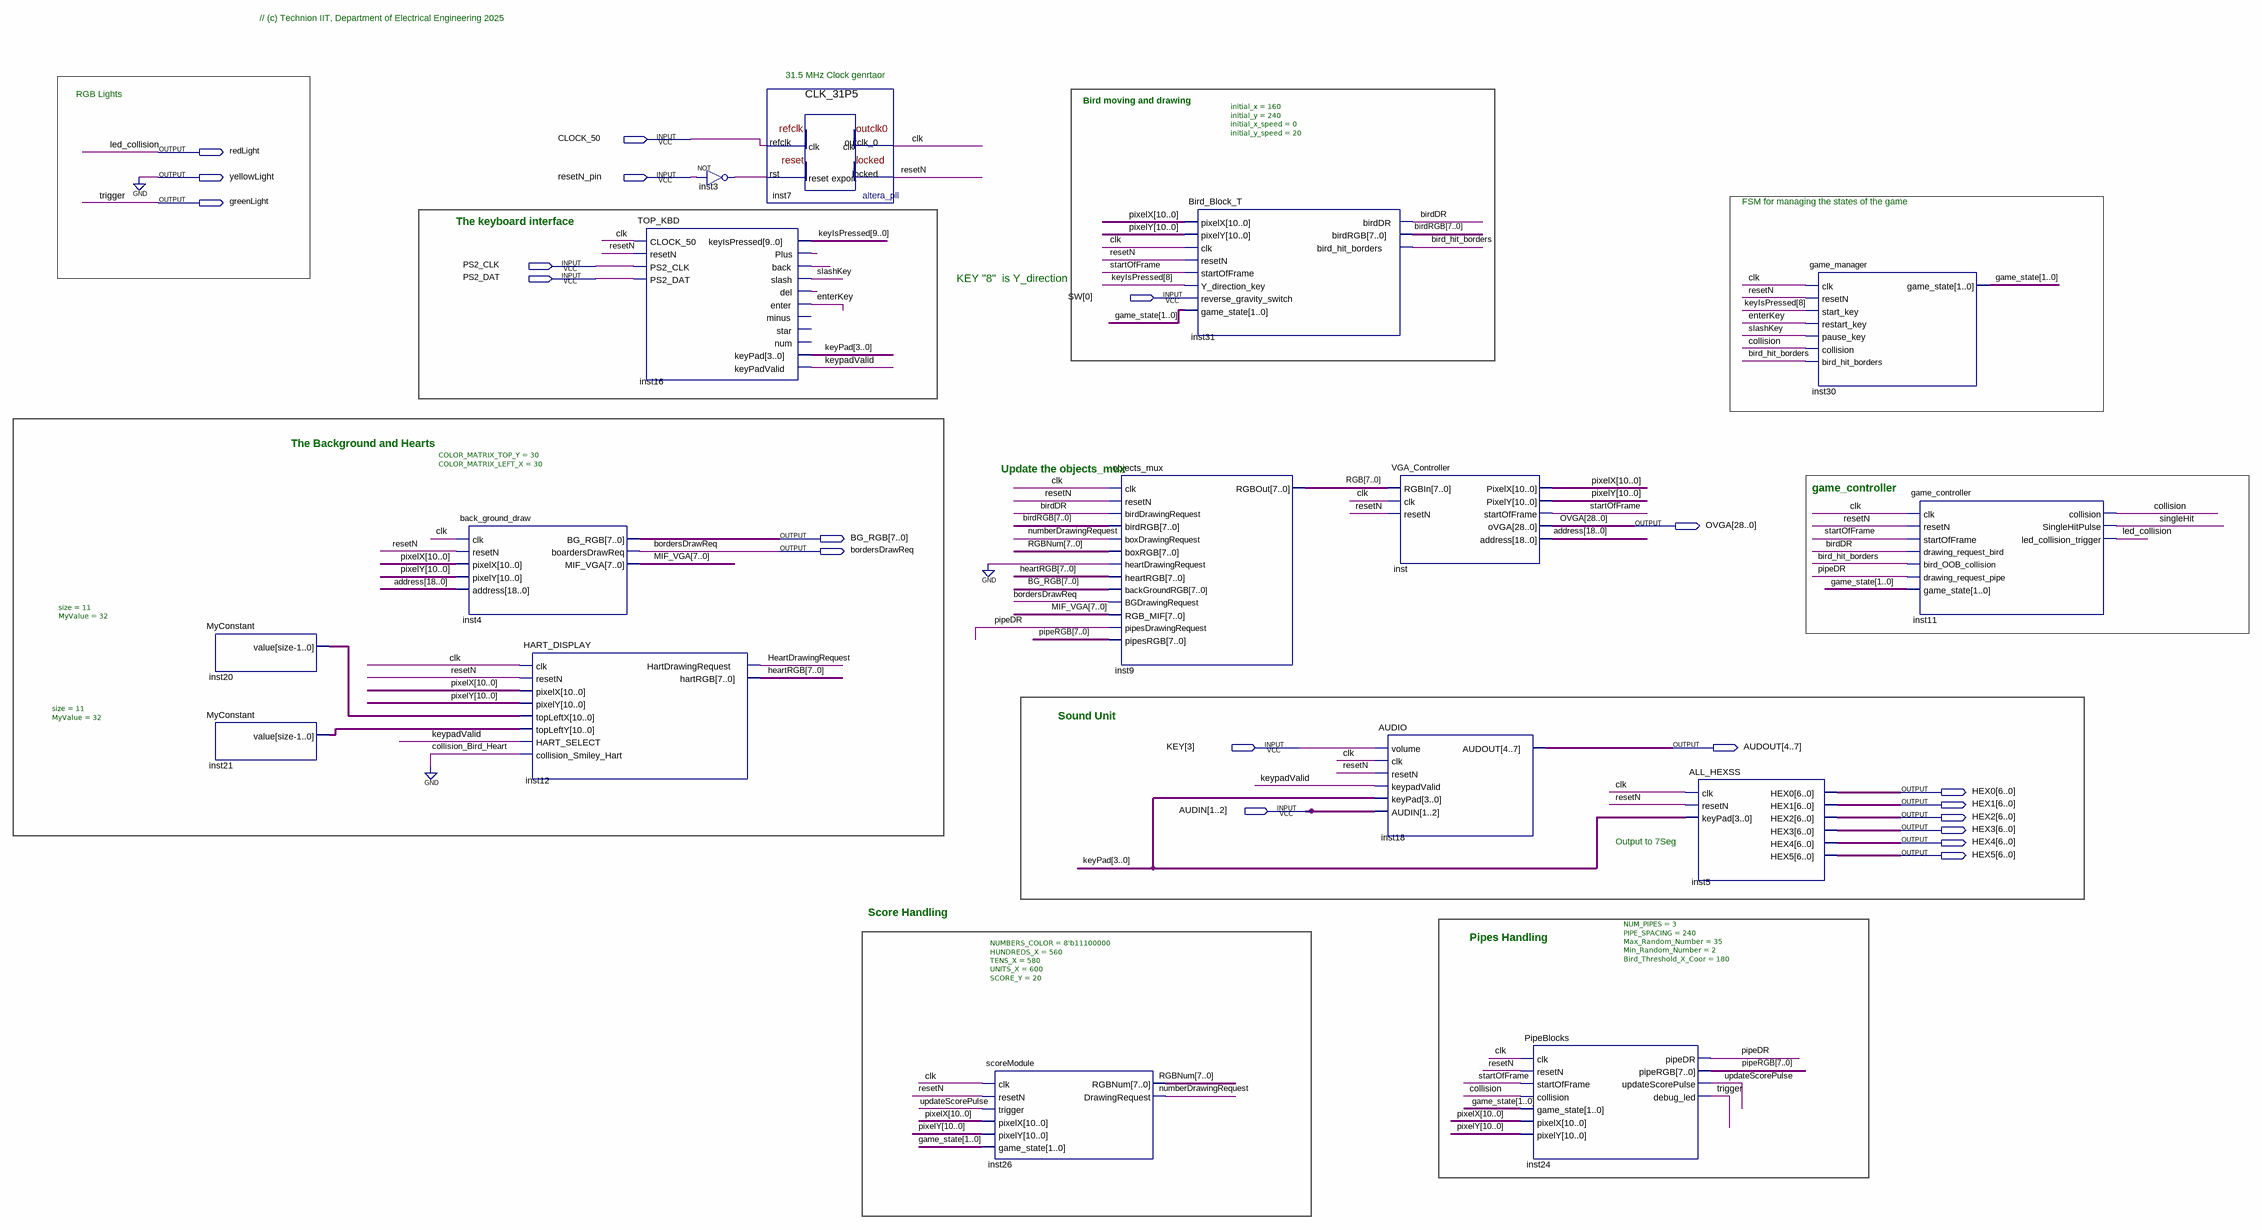
[diagram p0: schematic sheet]
// Quartus schematic TOP_VGA_DEMO.bdf as structural Verilog: 16 symbols, 20 pins
module TOP_VGA_DEMO (
  input  CLOCK_50,
  input  resetN_pin,
  input  PS2_CLK,
  input  PS2_DAT,
  input  [0:0] SW,
  input  [3:3] KEY,
  input  [1:2] AUDIN,
  output redLight,
  output yellowLight,
  output greenLight,
  output [28:0] OVGA,
  output [7:0] BG_RGB,
  output bordersDrawReq,
  output [4:7] AUDOUT,
  output [6:0] HEX0,
  output [6:0] HEX1,
  output [6:0] HEX2,
  output [6:0] HEX3,
  output [6:0] HEX4,
  output [6:0] HEX5
);

  wire bird_hit_borders, birdDR, clk, collision, enterKey, HeartDrawingRequest, inst3_out, inst16_back,
       inst16_del, inst16_plus, keypadValid, numberDrawingRequest, pipeDR, resetN, singleHit, slashKey,
       startOfFrame, updateScorePulse;
  wire [1:0] game_state;
  wire [3:0] keyPad;
  wire [7:0] birdRGB, heartRGB, MIF_VGA, pipeRGB, RGB, RGBNum;
  wire [9:0] keyIsPressed;
  wire [10:0] inst20_value, inst21_value, pixelX, pixelY;
  wire [18:0] address;

  MyConstant #(.size(11), .MyValue(32)) inst20 (.value(inst20_value));
  MyConstant #(.size(11), .MyValue(32)) inst21 (.value(inst21_value));
  back_ground_draw #(.COLOR_MATRIX_TOP_Y(30), .COLOR_MATRIX_LEFT_X(30)) inst4 (
    .clk(clk), .resetN(resetN), .pixelX(pixelX), .pixelY(pixelY), .address(address), .BG_RGB(BG_RGB),
    .boardersDrawReq(bordersDrawReq), .MIF_VGA(MIF_VGA));
  HART_DISPLAY inst12 (
    .clk(clk), .resetN(resetN), .pixelX(pixelX), .pixelY(pixelY), .topLeftX(inst20_value),
    .topLeftY(inst21_value), .HART_SELECT(keypadValid), .collision_Smiley_Hart(1'b0),
    .HartDrawingRequest(HeartDrawingRequest), .hartRGB(heartRGB));
  TOP_KBD inst16 (
    .CLOCK_50(clk), .resetN(resetN), .PS2_CLK(PS2_CLK), .PS2_DAT(PS2_DAT), .keyIsPressed(keyIsPressed),
    .Plus(inst16_plus), .back(inst16_back), .slash(slashKey), .del(inst16_del), .enter(enterKey),
    .keyPad(keyPad), .keyPadValid(keypadValid));  // open: minus, star, num
  not inst3 (inst3_out, resetN_pin);
  CLK_31P5 inst7 (.refclk(CLOCK_50), .rst(inst3_out), .outclk_0(clk), .locked(resetN));
  scoreModule #(.NUMBERS_COLOR(8'b11100000), .HUNDREDS_X(560), .TENS_X(580), .UNITS_X(600), .SCORE_Y(20)) inst26 (
    .clk(clk), .resetN(resetN), .trigger(updateScorePulse), .pixelX(pixelX), .pixelY(pixelY),
    .game_state(game_state), .RGBNum(RGBNum), .DrawingRequest(numberDrawingRequest));
  objects_mux inst9 (
    .clk(clk), .resetN(resetN), .birdDrawingRequest(birdDR), .birdRGB(birdRGB),
    .boxDrawingRequest(numberDrawingRequest), .boxRGB(RGBNum), .heartDrawingRequest(1'b0),
    .heartRGB(heartRGB), .backGroundRGB(BG_RGB), .BGDrawingRequest(bordersDrawReq), .RGB_MIF(MIF_VGA),
    .pipesDrawingRequest(pipeDR), .pipesRGB(pipeRGB), .RGBOut(RGB));
  Bird_Block_T #(.initial_x(160), .initial_y(240), .initial_x_speed(0), .initial_y_speed(20)) inst31 (
    .pixelX(pixelX), .pixelY(pixelY), .clk(clk), .resetN(resetN), .startOfFrame(startOfFrame),
    .Y_direction_key(keyIsPressed[8]), .reverse_gravity_switch(SW[0]), .game_state(game_state),
    .birdDR(birdDR), .birdRGB(birdRGB), .bird_hit_borders(bird_hit_borders));
  VGA_Controller inst (
    .RGBIn(RGB), .clk(clk), .resetN(resetN), .PixelX(pixelX), .PixelY(pixelY), .startOfFrame(startOfFrame),
    .oVGA(OVGA), .address(address));
  AUDIO inst18 (
    .volume(KEY[3]), .clk(clk), .resetN(resetN), .keypadValid(keypadValid), .keyPad(keyPad), .AUDIN(AUDIN),
    .AUDOUT(AUDOUT));
  PipeBlocks #(.NUM_PIPES(3), .PIPE_SPACING(240), .Max_Random_Number(35), .Min_Random_Number(2), .Bird_Threshold_X_Coor(180)) inst24 (
    .clk(clk), .resetN(resetN), .startOfFrame(startOfFrame), .collision(collision), .game_state(game_state),
    .pixelX(pixelX), .pixelY(pixelY), .pipeDR(pipeDR), .pipeRGB(pipeRGB),
    .updateScorePulse(updateScorePulse), .debug_led(greenLight));
  ALL_HEXSS inst5 (
    .clk(clk), .resetN(resetN), .keyPad(keyPad), .HEX0(HEX0), .HEX1(HEX1), .HEX2(HEX2), .HEX3(HEX3),
    .HEX4(HEX4), .HEX5(HEX5));
  game_manager inst30 (
    .clk(clk), .resetN(resetN), .start_key(keyIsPressed[8]), .restart_key(enterKey), .pause_key(slashKey),
    .collision(collision), .bird_hit_borders(bird_hit_borders), .game_state(game_state));
  game_controller inst11 (
    .clk(clk), .resetN(resetN), .startOfFrame(startOfFrame), .drawing_request_bird(birdDR),
    .bird_OOB_collision(bird_hit_borders), .drawing_request_pipe(pipeDR), .game_state(game_state),
    .collision(collision), .SingleHitPulse(singleHit), .led_collision_trigger(redLight));

  assign yellowLight = 1'b0;

  // Other names for the same wires on the sheet: led_collision = redLight; trigger = greenLight

  // Notes on the sheet:
  //   // (c) Technion IIT, Department of Electrical Engineering 2025
  //   31.5 MHz Clock genrtaor
  //   RGB Lights
  //   Bird moving and drawing
  //   FSM for managing the states of the game
  //   The keyboard interface
  //   KEY "8"  is Y_direction
  //   The Background and Hearts
  //   Update the objects_mux
  //   game_controller
  //   Sound Unit
  //   Output to 7Seg
  //   Score Handling
  //   Pipes Handling
endmodule
